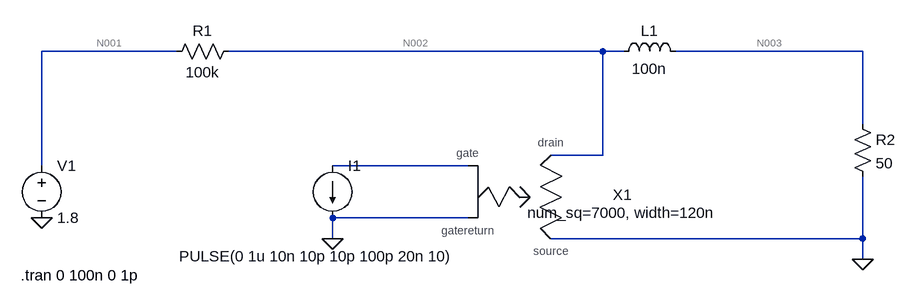
[diagram p0: schematic spd_MoSi_test.asc]
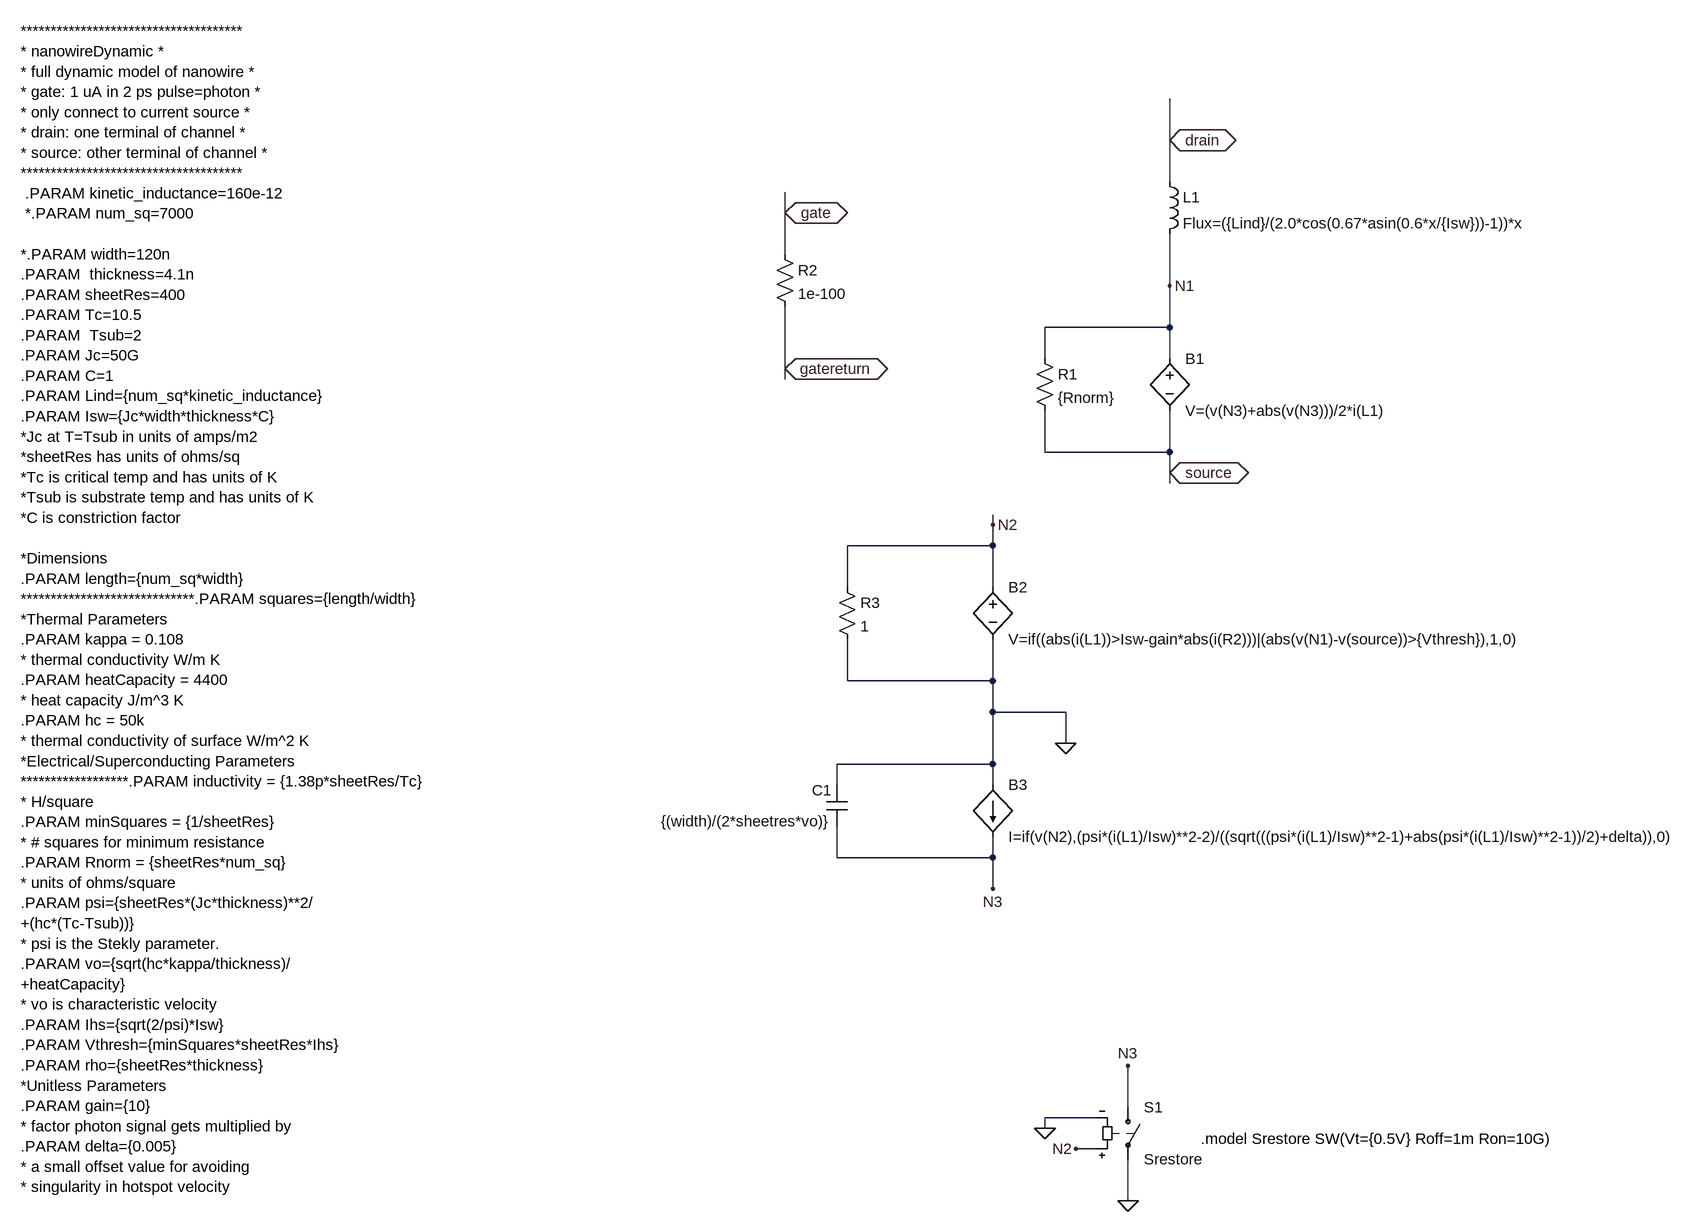
[diagram p1: sub-circuit spd_mosi.asc]
spd_MoSi_test.asc, the LTspice schematic file:
Version 4
SHEET 1 880 680
WIRE -320 -16 -528 -16
WIRE 336 -16 -240 -16
WIRE 368 -16 336 -16
WIRE 736 -16 448 -16
WIRE 736 96 736 -16
WIRE 336 144 336 -16
WIRE 336 144 256 144
WIRE -528 160 -528 -16
WIRE 128 160 -80 160
WIRE 128 240 -80 240
WIRE -80 272 -80 240
WIRE 736 272 736 176
WIRE 736 272 256 272
WIRE 736 304 736 272
FLAG -528 240 0
FLAG 736 304 0
FLAG -80 272 0
SYMBOL current -80 160 R0
WINDOW 3 -236 139 Left 2
WINDOW 123 0 0 Left 0
WINDOW 39 0 0 Left 0
SYMATTR Value PULSE(0 1u 10n 10p 10p 100p 20n 10)
SYMATTR InstName I1
SYMBOL voltage -528 144 R0
WINDOW 123 0 0 Left 0
WINDOW 39 0 0 Left 0
SYMATTR InstName V1
SYMATTR Value 1.8
SYMBOL res -224 -32 R90
WINDOW 0 0 56 VBottom 2
WINDOW 3 32 56 VTop 2
SYMATTR InstName R1
SYMATTR Value 100k
SYMBOL ind 352 0 R270
WINDOW 0 32 56 VTop 2
WINDOW 3 5 56 VBottom 2
SYMATTR InstName L1
SYMATTR Value 100n
SYMBOL res 720 80 R0
SYMATTR InstName R2
SYMATTR Value 50
SYMBOL spd_MoSi 224 208 R0
WINDOW 39 142 40 Bottom 2
SYMATTR InstName X1
SYMATTR SpiceLine num_sq=7000, width=120n
TEXT -560 328 Left 2 !.tran 0 100n 0 1p

spd_mosi.asc, the sub-circuit schematic file:
Version 4
SHEET 1 2728 1668
WIRE 1696 16 1696 -48
WIRE 1696 80 1696 16
WIRE 1104 128 1104 96
WIRE 1104 192 1104 128
WIRE 1696 240 1696 160
WIRE 1696 304 1696 240
WIRE 1696 304 1504 304
WIRE 1504 352 1504 304
WIRE 1696 352 1696 304
WIRE 1104 368 1104 272
WIRE 1104 384 1104 368
WIRE 1504 496 1504 432
WIRE 1696 496 1696 432
WIRE 1696 496 1504 496
WIRE 1696 528 1696 496
WIRE 1696 544 1696 528
WIRE 1424 608 1424 592
WIRE 1424 640 1424 608
WIRE 1424 640 1200 640
WIRE 1200 704 1200 640
WIRE 1424 704 1424 640
WIRE 1200 848 1200 784
WIRE 1424 848 1424 784
WIRE 1424 848 1200 848
WIRE 1424 896 1424 848
WIRE 1536 896 1424 896
WIRE 1536 944 1536 896
WIRE 1424 976 1424 896
WIRE 1424 976 1184 976
WIRE 1184 1008 1184 976
WIRE 1424 1008 1424 976
WIRE 1184 1120 1184 1072
WIRE 1424 1120 1424 1088
WIRE 1424 1120 1184 1120
WIRE 1424 1168 1424 1120
WIRE 1632 1504 1632 1440
WIRE 1584 1520 1504 1520
WIRE 1504 1536 1504 1520
WIRE 1584 1568 1552 1568
WIRE 1632 1648 1632 1584
FLAG 1696 16 drain
IOPIN 1696 16 BiDir
FLAG 1696 240 N1
FLAG 1696 528 source
IOPIN 1696 528 BiDir
FLAG 1104 128 gate
IOPIN 1104 128 BiDir
FLAG 1104 368 gatereturn
IOPIN 1104 368 BiDir
FLAG 1424 608 N2
FLAG 1536 944 0
FLAG 1424 1168 N3
FLAG 1504 1536 0
FLAG 1632 1648 0
FLAG 1632 1440 N3
FLAG 1552 1568 N2
SYMBOL ind 1680 64 R0
SYMATTR InstName L1
SYMATTR Value Flux=({Lind}/(2.0*cos(0.67*asin(0.6*x/{Isw}))-1))*x
SYMATTR SpiceLine Rser=1e-100
SYMBOL res 1488 336 R0
SYMATTR InstName R1
SYMATTR Value {Rnorm}
SYMBOL res 1088 176 R0
SYMATTR InstName R2
SYMATTR Value 1e-100
SYMBOL res 1184 688 R0
SYMATTR InstName R3
SYMATTR Value 1
SYMBOL cap 1200 1072 R180
WINDOW 3 24 8 Left 2
WINDOW 0 24 56 Left 2
SYMATTR Value {(width)/(2*sheetres*vo)}
SYMATTR InstName C1
SYMBOL sw 1632 1488 R0
SYMATTR InstName S1
SYMATTR Value Srestore
SYMATTR Value2 OFF
SYMBOL bv 1696 336 R0
SYMATTR InstName B1
SYMATTR Value V=(v(N3)+abs(v(N3)))/2*i(L1)
SYMBOL bv 1424 688 R0
SYMATTR InstName B2
SYMATTR Value V=if((abs(i(L1))>Isw-gain*abs(i(R2)))|(abs(v(N1)-v(source))>{Vthresh}),1,0)
SYMBOL bi 1424 1008 R0
SYMATTR InstName B3
SYMATTR Value I=if(v(N2),(psi*(i(L1)/Isw)**2-2)/((sqrt(((psi*(i(L1)/Isw)**2-1)+abs(psi*(i(L1)/Isw)**2-1))/2)+delta)),0)
TEXT -72 -152 Left 2 !*************************************\n* nanowireDynamic *\n* full dynamic model of nanowire *\n* gate: 1 uA in 2 ps pulse=photon *\n* only connect to current source *\n* drain: one terminal of channel *\n* source: other terminal of channel *\n*************************************\n .PARAM kinetic_inductance=160e-12\n *.PARAM num_sq=7000\n \n*.PARAM width=120n\n.PARAM  thickness=4.1n\n.PARAM sheetRes=400\n.PARAM Tc=10.5\n.PARAM  Tsub=2 \n.PARAM Jc=50G \n.PARAM C=1\n.PARAM Lind={num_sq*kinetic_inductance}   \n.PARAM Isw={Jc*width*thickness*C} \n*Jc at T=Tsub in units of amps/m2\n*sheetRes has units of ohms/sq\n*Tc is critical temp and has units of K\n*Tsub is substrate temp and has units of K\n*C is constriction factor\n \n*Dimensions\n.PARAM length={num_sq*width}\n*****************************.PARAM squares={length/width}\n*Thermal Parameters\n.PARAM kappa = 0.108\n* thermal conductivity W/m K\n.PARAM heatCapacity = 4400\n* heat capacity J/m^3 K\n.PARAM hc = 50k\n* thermal conductivity of surface W/m^2 K\n*Electrical/Superconducting Parameters\n******************.PARAM inductivity = {1.38p*sheetRes/Tc}\n* H/square\n.PARAM minSquares = {1/sheetRes}\n* # squares for minimum resistance\n.PARAM Rnorm = {sheetRes*num_sq}\n* units of ohms/square\n.PARAM psi={sheetRes*(Jc*thickness)**2/\n+(hc*(Tc-Tsub))}\n* psi is the Stekly parameter.\n.PARAM vo={sqrt(hc*kappa/thickness)/\n+heatCapacity}\n* vo is characteristic velocity\n.PARAM Ihs={sqrt(2/psi)*Isw}\n.PARAM Vthresh={minSquares*sheetRes*Ihs}\n.PARAM rho={sheetRes*thickness}\n*Unitless Parameters\n.PARAM gain={10}\n* factor photon signal gets multiplied by\n.PARAM delta={0.005}\n* a small offset value for avoiding\n* singularity in hotspot velocity
TEXT 1744 1552 Left 2 !.model Srestore SW(Vt={0.5V} Roff=1m Ron=10G)

The netlist it stands for:
* spd_MoSi_test.asc
I1 N004 0 PULSE(0 1u 10n 10p 10p 100p 20n 10)
V1 N001 0 1.8
R1 N002 N001 100k
L1 N002 N003 100n
R2 N003 0 50
XX1 N002 N004 0 0 spd_mosi params: num_sq=7000, width=120n

* block symbol definitions
.subckt spd_mosi drain gate gatereturn source
L1 drain N1 Flux=({Lind}/(2.0*cos(0.67*asin(0.6*x/{Isw}))-1))*x Rser=1e-100
R1 N1 source {Rnorm}
R2 gate gatereturn 1e-100
R3 N2 0 1
C1 N3 0 {(width)/(2*sheetres*vo)}
S1 N3 0 N2 0 Srestore OFF
B1 N1 source V=(v(N3)+abs(v(N3)))/2*i(L1)
B2 N2 0 V=if((abs(i(L1))>Isw-gain*abs(i(R2)))|(abs(v(N1)-v(source))>{Vthresh}),1,0)
B3 0 N3 I=if(v(N2),(psi*(i(L1)/Isw)**2-2)/((sqrt(((psi*(i(L1)/Isw)**2-1)+abs(psi*(i(L1)/Isw)**2-1))/2)+delta)),0)
*************************************
* nanowireDynamic *
* full dynamic model of nanowire *
* gate: 1 uA in 2 ps pulse=photon *
* only connect to current source *
* drain: one terminal of channel *
* source: other terminal of channel *
*************************************
 .PARAM kinetic_inductance=160e-12
 *.PARAM num_sq=7000
*.PARAM width=120n
.PARAM  thickness=4.1n
.PARAM sheetRes=400
.PARAM Tc=10.5
.PARAM  Tsub=2
.PARAM Jc=50G
.PARAM C=1
.PARAM Lind={num_sq*kinetic_inductance}
.PARAM Isw={Jc*width*thickness*C}
*Jc at T=Tsub in units of amps/m2
*sheetRes has units of ohms/sq
*Tc is critical temp and has units of K
*Tsub is substrate temp and has units of K
*C is constriction factor
*Dimensions
.PARAM length={num_sq*width}
*****************************.PARAM squares={length/width}
*Thermal Parameters
.PARAM kappa = 0.108
* thermal conductivity W/m K
.PARAM heatCapacity = 4400
* heat capacity J/m^3 K
.PARAM hc = 50k
* thermal conductivity of surface W/m^2 K
*Electrical/Superconducting Parameters
******************.PARAM inductivity = {1.38p*sheetRes/Tc}
* H/square
.PARAM minSquares = {1/sheetRes}
* # squares for minimum resistance
.PARAM Rnorm = {sheetRes*num_sq}
* units of ohms/square
.PARAM psi={sheetRes*(Jc*thickness)**2/
+(hc*(Tc-Tsub))}
* psi is the Stekly parameter.
.PARAM vo={sqrt(hc*kappa/thickness)/
+heatCapacity}
* vo is characteristic velocity
.PARAM Ihs={sqrt(2/psi)*Isw}
.PARAM Vthresh={minSquares*sheetRes*Ihs}
.PARAM rho={sheetRes*thickness}
*Unitless Parameters
.PARAM gain={10}
* factor photon signal gets multiplied by
.PARAM delta={0.005}
* a small offset value for avoiding
* singularity in hotspot velocity
.model Srestore SW(Vt={0.5V} Roff=1m Ron=10G)
.ends spd_mosi

.tran 0 100n 0 1p
.backanno
.end

* Results of the author's LTspice run, read from the files saved beside the schematic
* Operating Point, zero values left out:
*   V(n001) = 1.8 V
*   I(R1) = -18 µA
*   I(V1) = -18 µA
*   Ix(x1:DRAIN) = 18 µA
*   Ix(x1:SOURCE) = -18 µA
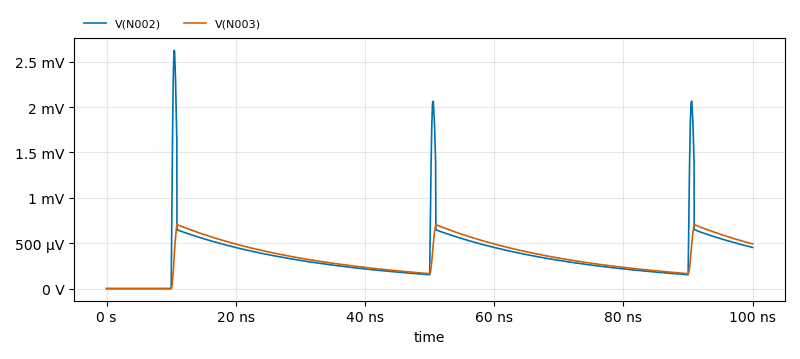
[diagram p2: Transient Analysis of spd_MoSi_test.asc, plotted from the saved traces]
* Transient Analysis, 1 run:
*   V(N002): min -2.077 µV, max 2.625 mV, average 358.6 µV, rms 467.7 µV, last 453.4 µV
*   V(N003): min -2.707 nV, max 705.6 µV, average 349 µV, rms 399 µV, last 491.7 µV